# Altium schematic sheet Audio Power Supply.SchDoc
size A3; Date: 27.05.2014; DrawnBy: luths8; Organization: BFH; Address1: Bern University of Applied Sciences; Address2: Engineering and Information Technology; Address3: Jlcoweg 1; Address4: CH-3400 Burgdorf; DocumentNumber: 2; Revision: 1.0; SheetNumber: 2; SheetTotal: 19; CurrentDate: 27.05.2014
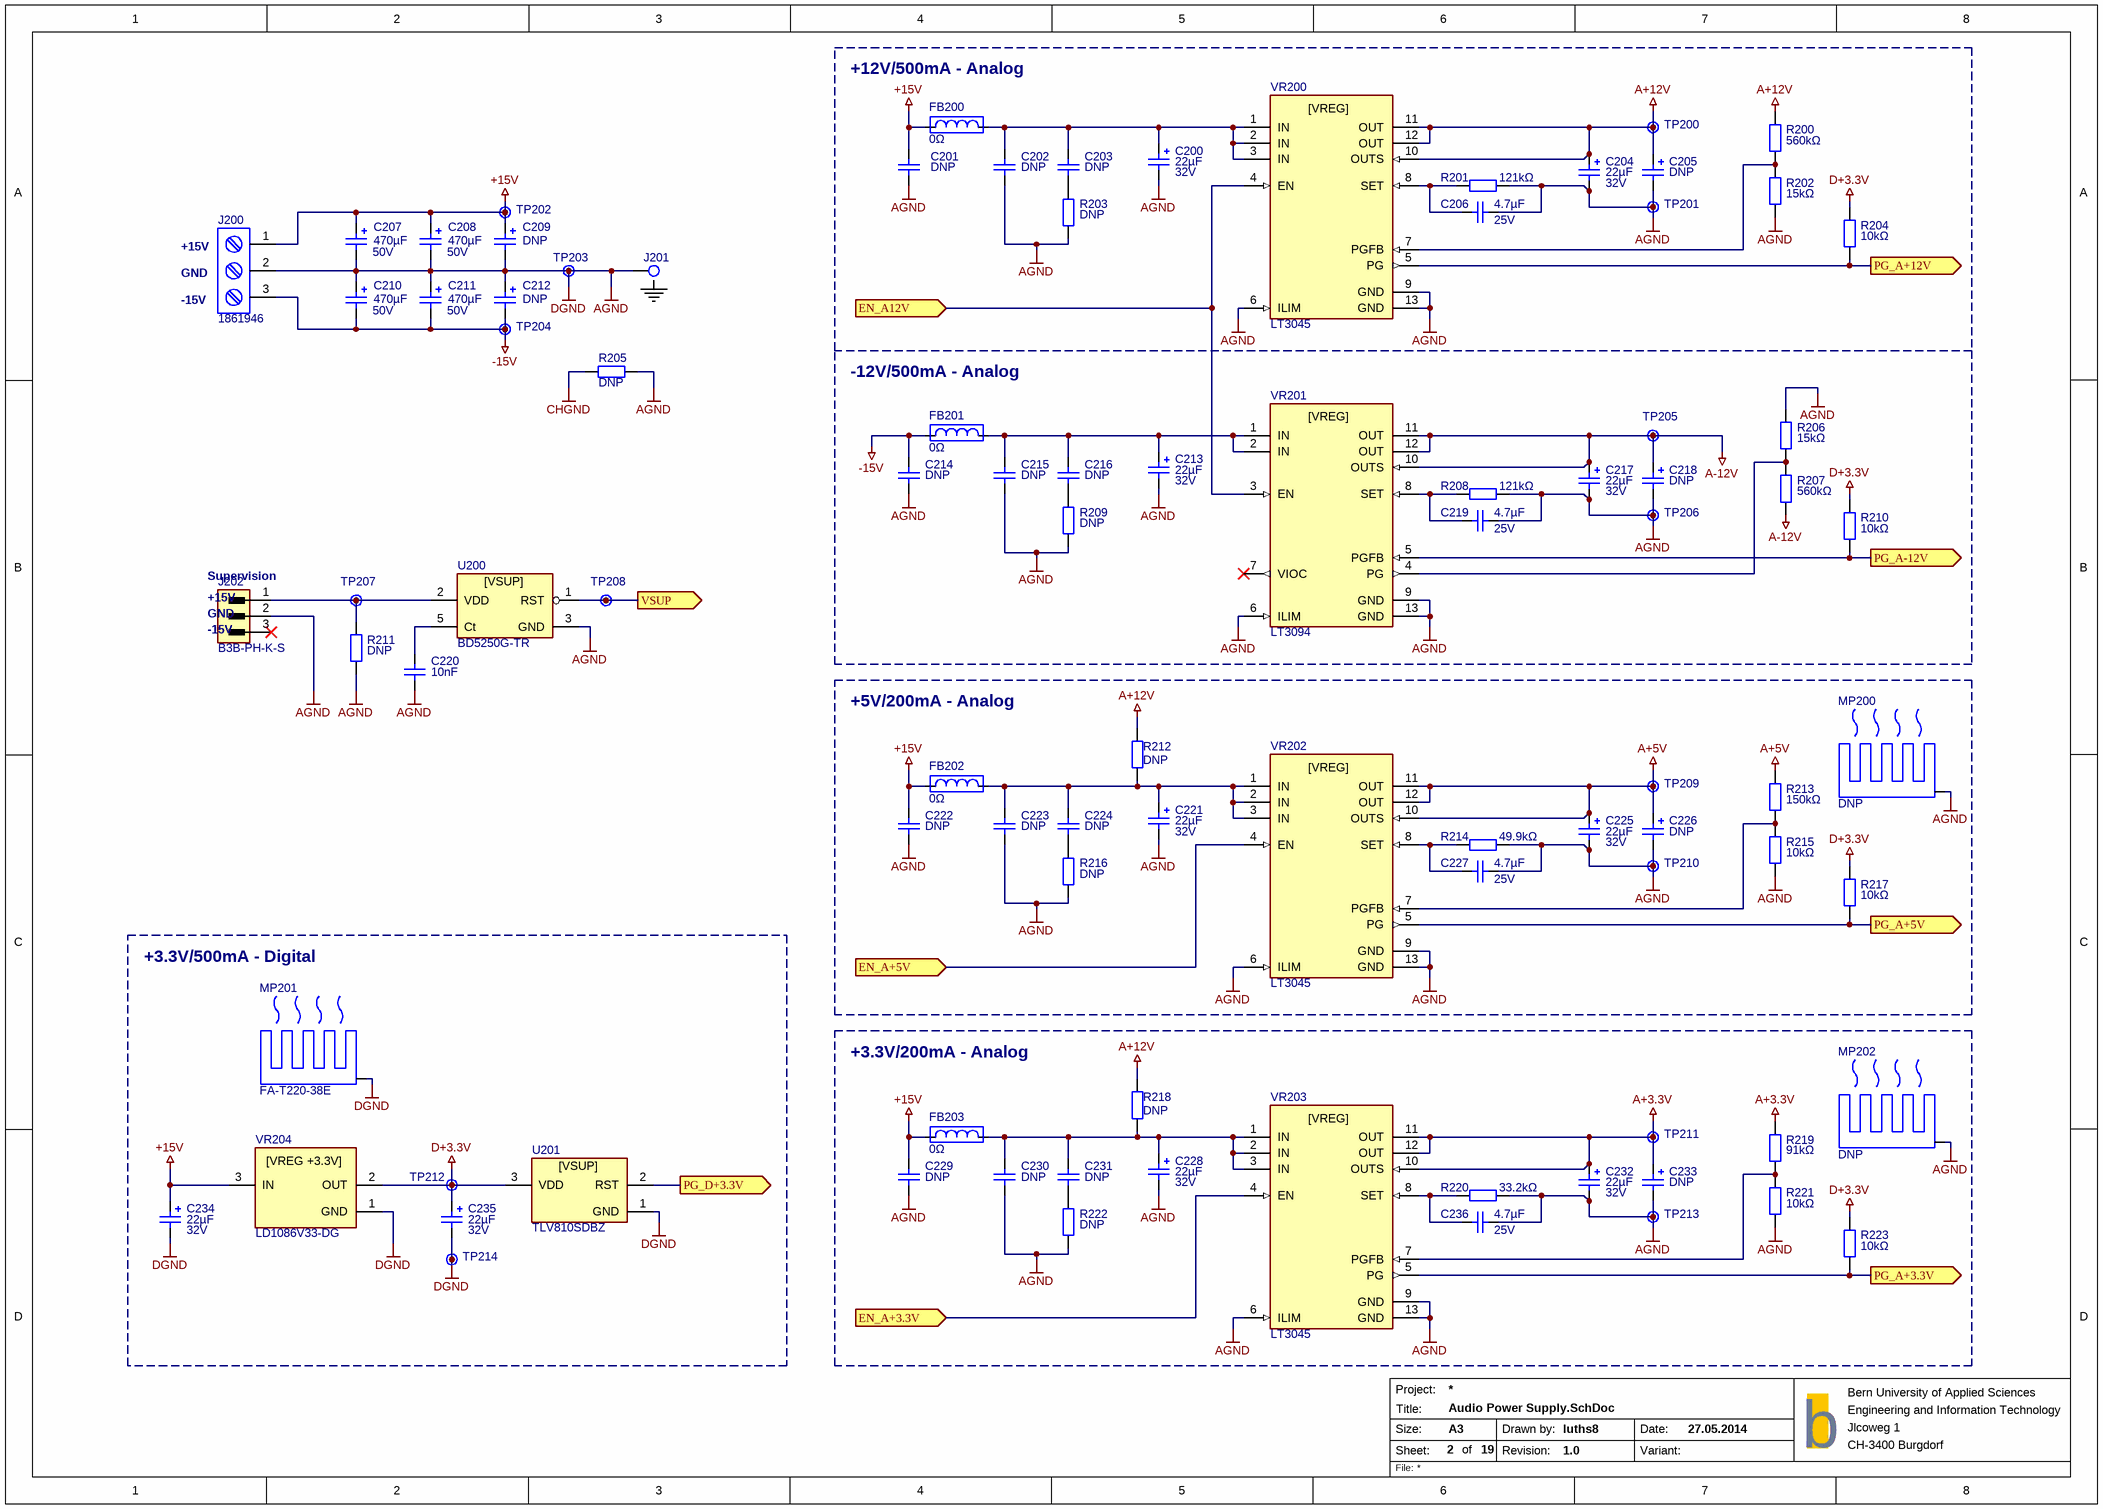
[diagram p0: Audio Power Supply.SchDoc]

## Parts
C200  22µF  Voltage: 32V  [CAP-6.3-5.5-2.5]
C201  DNP  [SMD0805CAP]
C202  DNP  [SMD0805CAP]
C203  DNP  [SMD0805CAP]
C204  22µF  Voltage: 32V  [CAP-6.3-5.5-2.5]
C205  DNP  [CAP-6.3-5.5-2.5]
C206  4.7µF  Voltage: 25V  [SMD1206CAP]
C207  470µF  Voltage: 50V  [CAP-12.5-20-5]
C208  470µF  Voltage: 50V  [CAP-12.5-20-5]
C209  DNP  [CAP-12.5-20-5]
C210  470µF  Voltage: 50V  [CAP-12.5-20-5]
C211  470µF  Voltage: 50V  [CAP-12.5-20-5]
C212  DNP  [CAP-12.5-20-5]
C213  22µF  Voltage: 32V  [CAP-6.3-5.5-2.5]
C214  DNP  [SMD0805CAP]
C215  DNP  [SMD0805CAP]
C216  DNP  [SMD0805CAP]
C217  22µF  Voltage: 32V  [CAP-6.3-5.5-2.5]
C218  DNP  [CAP-6.3-5.5-2.5]
C219  4.7µF  Voltage: 25V  [SMD1206CAP]
C220  10nF  [SMD0603CAP]
C221  22µF  Voltage: 32V  [CAP-6.3-5.5-2.5]
C222  DNP  [SMD0805CAP]
C223  DNP  [SMD0805CAP]
C224  DNP  [SMD0805CAP]
C225  22µF  Voltage: 32V  [CAP-6.3-5.5-2.5]
C226  DNP  [CAP-6.3-5.5-2.5]
C227  4.7µF  Voltage: 25V  [SMD1206CAP]
C228  22µF  Voltage: 32V  [CAP-6.3-5.5-2.5]
C229  DNP  [SMD0805CAP]
C230  DNP  [SMD0805CAP]
C231  DNP  [SMD0805CAP]
C232  22µF  Voltage: 32V  [CAP-6.3-5.5-2.5]
C233  DNP  [CAP-6.3-5.5-2.5]
C234  22µF  Voltage: 32V  [CAP-6.3-5.5-2.5]
C235  22µF  Voltage: 32V  [CAP-6.3-5.5-2.5]
C236  4.7µF  Voltage: 25V  [SMD1206CAP]
FB200  0Ω  [SMD0603RES]
FB201  0Ω  [SMD0603RES]
FB202  0Ω  [SMD0603RES]
FB203  0Ω  [SMD0603RES]
J200  1861946  [1861946]
J201  Solder Pin  [SOLDER_PIN]  (value not drawn)  (net tie, no BOM)
J202  B3B-PH-K-S  [B3B-PH-K-S]
MP200  DNP  [DA-T263-201E]
MP201  FA-T220-38E  [FA-T220-38E]
MP202  DNP  [DA-T263-201E]
R200  560kΩ  [SMD0603RES]
R201  121kΩ  [SMD0603RES]
R202  15kΩ  [SMD0603RES]
R203  DNP  [SMD0603RES]
R204  10kΩ  [SMD0603RES]
R205  DNP  [SMD0805RES]
R206  15kΩ  [SMD0603RES]
R207  560kΩ  [SMD0603RES]
R208  121kΩ  [SMD0603RES]
R209  DNP  [SMD0603RES]
R210  10kΩ  [SMD0603RES]
R211  DNP  [SMD0603RES]
R212  DNP  [SMD0603RES]
R213  150kΩ  [SMD0603RES]
R214  49.9kΩ  [SMD0603RES]
R215  10kΩ  [SMD0603RES]
R216  DNP  [SMD0603RES]
R217  10kΩ  [SMD0603RES]
R218  DNP  [SMD0603RES]
R219  91kΩ  [SMD0603RES]
R220  33.2kΩ  [SMD0603RES]
R221  10kΩ  [SMD0603RES]
R222  DNP  [SMD0603RES]
R223  10kΩ  [SMD0603RES]
TP200  Testpoint  [TP]  (value not drawn)  (no BOM)
TP201  Testpoint  [TP]  (value not drawn)  (no BOM)
TP202  Testpoint  [TP]  (value not drawn)  (no BOM)
TP203  Testpoint  [TP]  (value not drawn)  (no BOM)
TP204  Testpoint  [TP]  (value not drawn)  (no BOM)
TP205  Testpoint  [TP]  (value not drawn)  (no BOM)
TP206  Testpoint  [TP]  (value not drawn)  (no BOM)
TP207  Testpoint  [TP]  (value not drawn)  (no BOM)
TP208  Testpoint  [TP]  (value not drawn)  (no BOM)
TP209  Testpoint  [TP]  (value not drawn)  (no BOM)
TP210  Testpoint  [TP]  (value not drawn)  (no BOM)
TP211  Testpoint  [TP]  (value not drawn)  (no BOM)
TP212  Testpoint  [TP]  (value not drawn)  (no BOM)
TP213  Testpoint  [TP]  (value not drawn)  (no BOM)
TP214  Testpoint  [TP]  (value not drawn)  (no BOM)
U200  BD5250G-TR  [SOT-23-5]
U201  TLV810SDBZ  [SOT-23]
VR200  LT3045  [MSOP12]
VR201  LT3094  [MSOP12]
VR202  LT3045  [MSOP12]
VR203  LT3045  [MSOP12]
VR204  LD1086V33-DG  [TO220-3]

## Blocks framed on the sheet
+12V/500mA - Analog: C200-C206 FB200 R200-R204 TP200 TP201 VR200
+5V/200mA - Analog: C221-C227 FB202 MP200 R212-R217 TP209 TP210 VR202
+3.3V/500mA - Digital: C234 C235 MP201 TP212 TP214 U201 VR204
+3.3V/200mA - Analog: C228-C233 C236 FB203 MP202 R218-R223 TP211 TP213 VR203

## Ports
EN_A12V (in), EN_A+3.3V (in), EN_A+5V (in), PG_A+3.3V (out), PG_A+5V (out), PG_A+12V (out), PG_A-12V (out), PG_D+3.3V (out), VSUP (out)

## Nets
+15V: C201.2(q) C207.P C208.P C209.P C222.2(q) C229.2(q) C234.P FB200.1 FB202.1 FB203.1 J200.1 TP202.1 VR204.3(IN)
-15V: C210.M(q) C211.M(q) C212.M(q) C214.2(q) FB201.1 J200.3 TP204.1
A+3.3V: C232.P C233.P R219.2 TP211.1 VR203.10(OUTS) VR203.11(OUT) VR203.12(OUT)
A+5V: C225.P C226.P R213.2 TP209.1 VR202.10(OUTS) VR202.11(OUT) VR202.12(OUT)
A+12V: C204.P C205.P R200.2 R212.1 R218.1 TP200.1 VR200.10(OUTS) VR200.11(OUT) VR200.12(OUT)
A-12V: C217.P C218.P R207.2 TP205.1 VR201.10(OUTS) VR201.11(OUT) VR201.12(OUT)
AGND: C200.M(q) C201.1 C202.1 C204.M(q) C205.M(q) C206.2(q) C207.M(q) C208.M(q) C209.M(q) C210.P C211.P C212.P C213.M(q) C214.1 C215.1 C217.M(q) C218.M(q) C219.2(q) C220.1 C221.M(q) C222.1 C223.1 C225.M(q) C226.M(q) C227.2(q) C228.M(q) C229.1 C230.1 C232.M(q) C233.M(q) C234.M(q) C235.M(q) C236.2(q) J200.2 J201.1 J202.2 MP200.0 MP201.0 MP202.0 R201.2 R202.1 R203.1 R205.1 R206.1 R208.2 R209.1 R211.1 R214.2 R215.1 R216.1 R220.2 R221.1 R222.1 TP201.1 TP203.1 TP206.1 TP210.1 TP213.1 TP214.1 U200.3(GND) U201.1(GND) VR200.6(ILIM) VR200.9(GND) VR200.13(GND) VR201.6(ILIM) VR201.9(GND) VR201.13(GND) VR202.6(ILIM) VR202.9(GND) VR202.13(GND) VR203.6(ILIM) VR203.9(GND) VR203.13(GND) VR204.1(GND)  [also labelled DGND]
CHGND: R205.2
D+3.3V: C235.P R204.2 R210.2 R217.2 R223.2 TP212.1 U201.3(VDD) VR204.2(OUT)
EN_A12V: VR200.4(EN) VR201.3(EN) ; port EN_A12V
EN_A+3.3V: VR203.4(EN) ; port EN_A+3.3V
EN_A+5V: VR202.4(EN) ; port EN_A+5V
PG_A+3.3V: R223.1 VR203.5(PG) ; port PG_A+3.3V
PG_A+5V: R217.1 VR202.5(PG) ; port PG_A+5V
PG_A+12V: R204.1 VR200.5(PG) ; port PG_A+12V
PG_A-12V: R210.1 VR201.5(PGFB) ; port PG_A-12V
PG_D+3.3V: U201.2(RST) ; port PG_D+3.3V
VSUP: TP208.1 U200.1(RST) ; port VSUP
NetC200_P: C200.P C202.2(q) C203.2(q) FB200.2 VR200.1(IN) VR200.2(IN) VR200.3(IN)
NetC203_1: C203.1 R203.2
NetC206_1: C206.1 R201.1 VR200.8(SET)
NetC213_P: C213.P C215.2(q) C216.2(q) FB201.2 VR201.1(IN) VR201.2(IN)
NetC216_1: C216.1 R209.2
NetC219_1: C219.1 R208.1 VR201.8(SET)
NetC220_2: C220.2(q) U200.5(Ct)
NetC221_P: C221.P C223.2(q) C224.2(q) FB202.2 R212.2 VR202.1(IN) VR202.2(IN) VR202.3(IN)
NetC224_1: C224.1 R216.2
NetC227_1: C227.1 R214.1 VR202.8(SET)
NetC228_P: C228.P C230.2(q) C231.2(q) FB203.2 R218.2 VR203.1(IN) VR203.2(IN) VR203.3(IN)
NetC231_1: C231.1 R222.2
NetC236_1: C236.1 R220.1 VR203.8(SET)
NetJ202_1: J202.1 R211.2 TP207.1 U200.2(VDD)
NetR200_1: R200.1 R202.2 VR200.7(PGFB)
NetR206_2: R206.2 R207.1 VR201.4(PG)
NetR213_1: R213.1 R215.2 VR202.7(PGFB)
NetR219_1: R219.1 R221.2 VR203.7(PGFB)

Not connected (* = marked no-connect by the designer): J202 3*; VR201 7(VIOC)*

## Notes on the sheet
- (near J200) +15V
- (near J200) GND
- (near J200) -15V
- (near FB201) -12V/500mA - Analog
- (near J202) Supervision
- (near J202) +15V
- (near J202) GND
- (near J202) -15V
- Project:
- Size:
- Sheet:
- Title:
- A3
- of
- Drawn by:
- Revision:
- Date:
- Variant:
- b
- File:
- (in symbol LD1086V33-DG) [VREG +3.3V]
- (in symbol LT3045) [VREG]
- (in symbol LT3094) [VREG]
- (in symbol Voltage Supervisor) [VSUP]
- (in symbol Voltage Supervisor 5V) [VSUP]

## Library data of the parts
C200 C204 C213 C217 C221 C225 C228 C232 C234 C235 = Capacitor Electrolytic: Elektrolytic Capacitor; Manufacturer Part No.: 32SEPF22M
C201-C203 C214-C216 C220 C222-C224 C229-C231 = Capacitor Ceramic: Ceramic Capacitor; Voltage: 25V; Manufacturer Part No.: *
C205 C218 C226 C233 = Capacitor Electrolytic: Elektrolytic Capacitor; Manufacturer Part No.: 32SEPF22M; Voltage: 32V
C206 C219 C227 C236 = Capacitor Ceramic: Ceramic Capacitor; Manufacturer Part No.: *
C207 C208 C210 C211 = Capacitor Electrolytic: Elektrolytic Capacitor; Manufacturer Part No.: EEU-FR1H471
C209 C212 = Capacitor Electrolytic: Elektrolytic Capacitor; Manufacturer Part No.: EEU-FR1H471; Voltage: 50V
FB200-FB203 = Ferrite Bead: Manufacturer Part No.: *
J200 = 1861946: Screw Terminal, 3 Position; System: Connector; Manufacturer Part No.: 1861946
J202 = Connector 3x1P: Manufacturer Part No.: B3B-PH-K-S; System: Connector
MP200-MP202 = Heatsink
  MP200 MP202: Manufacturer Part No.: DA-T263-201E
  MP201: Manufacturer Part No.: FA-T220-38E
R200-R223 = Resistor: Manufacturer Part No.: *
U200 = Voltage Supervisor 5V: Voltage Supervisor, Threshold 5V; Manufacturer Part No.: BD5250G-TR
U201 = Voltage Supervisor: Voltage Supervisor, Threshold 2.94V; Manufacturer Part No.: TLV810SDBZR
VR200 VR202 VR203 = LT3045: Linear Regulator, positive Rail, Low Noise, High PSRR; Manufacturer Part No.: LT3045EMSE#PBF
VR201 = LT3094: Linear Regulator, negative Rail Low Noise, High PSRR; Manufacturer Part No.: LT3094EMSE#PBF
VR204 = LD1086V33-DG: Linear Voltage Regulator, positive Rail; Manufacturer Part No.: LD1086V33-DG
TP200-TP214 = Testpoint: Manufacturer Part No.: *